# Altium project 电子脚铐便携式主控板V3-改版.PrjPcb
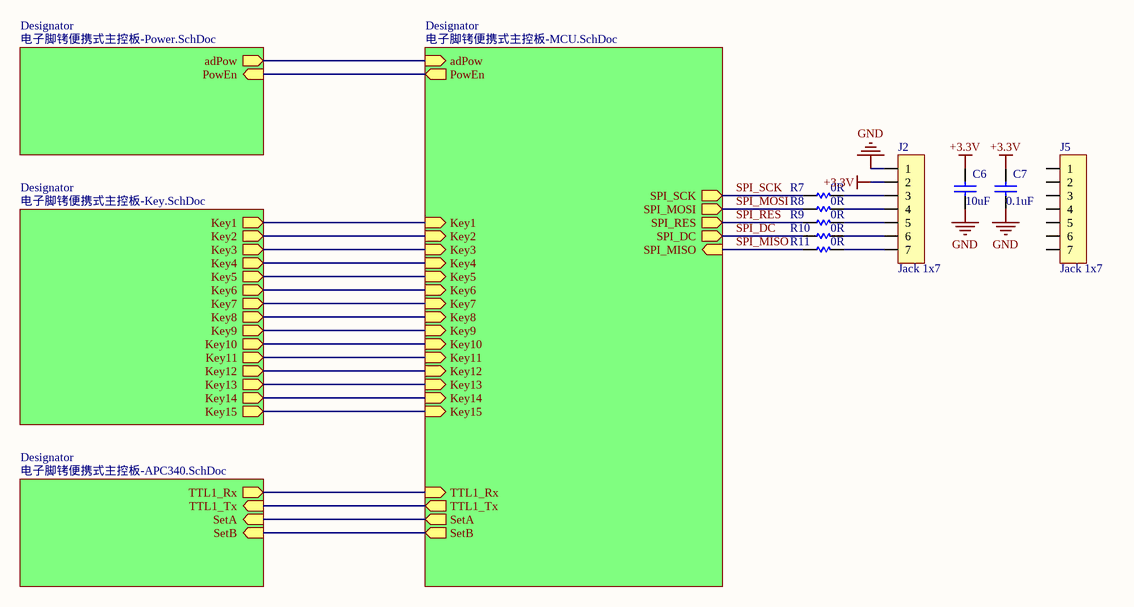
[diagram p0: 电子脚铐便携式主控板-Frame.SchDoc]
5 sheets, 104 parts. Net scope: hierarchical (ports join the sheet entries above them; power ports are global).
Board file: 电子脚铐便携式主控板V3-改版V1.PcbDoc
Sheets:
  电子脚铐便携式主控板-Frame.SchDoc
    Designator = 电子脚铐便携式主控板-Power.SchDoc
    Designator = 电子脚铐便携式主控板-Key.SchDoc
    Designator = 电子脚铐便携式主控板-MCU.SchDoc
    Designator = 电子脚铐便携式主控板-APC340.SchDoc

## Sheet 电子脚铐便携式主控板-Frame.SchDoc
size A4

### Parts
C6  10uF  [C0603]
C7  0.1uF  [C0603]
J2  Jack 1x7  [ZH-7AWD]
J5  Jack 1x7  [1.54OLED]
R7  0R  [R0603]
R8  0R  [R0603]
R9  0R  [R0603]
R10  0R  [R0603]
R11  0R  [R0603]

### Sub-sheets
Designator = 电子脚铐便携式主控板-Power.SchDoc: adPow (out), PowEn (in)
Designator = 电子脚铐便携式主控板-Key.SchDoc: Key1 (out), Key2 (out), Key3 (out), Key4 (out), Key5 (out), Key6 (out), Key7 (out), Key8 (out), Key9 (out), Key10 (out), Key11 (out), Key12 (out), Key13 (out), Key14 (out), Key15 (out)
Designator = 电子脚铐便携式主控板-MCU.SchDoc: adPow (in), PowEn (out), Key1 (in), Key2 (in), Key3 (in), Key4 (in), Key5 (in), Key6 (in), Key7 (in), Key8 (in), Key9 (in), Key10 (in), Key11 (in), Key12 (in), Key13 (in), Key14 (in), Key15 (in), TTL1_Rx (in), TTL1_Tx (out), SetA (out), SPI_MISO (in), SPI_MOSI (out), SPI_DC (out), SPI_SCK (out), SetB (out), SPI_RES (out)
Designator = 电子脚铐便携式主控板-APC340.SchDoc: TTL1_Rx (out), TTL1_Tx (in), SetA (in), SetB (in)

### Nets
+3.3V: C6.1 C7.1 J2.2
GND: C6.2 C7.2 J2.1
adPow: sheet Designator/adPow, sheet Designator/adPow
Key1: sheet Designator/Key1, sheet Designator/Key1
Key2: sheet Designator/Key2, sheet Designator/Key2
Key3: sheet Designator/Key3, sheet Designator/Key3
Key4: sheet Designator/Key4, sheet Designator/Key4
Key5: sheet Designator/Key5, sheet Designator/Key5
Key6: sheet Designator/Key6, sheet Designator/Key6
Key7: sheet Designator/Key7, sheet Designator/Key7
Key8: sheet Designator/Key8, sheet Designator/Key8
Key9: sheet Designator/Key9, sheet Designator/Key9
Key10: sheet Designator/Key10, sheet Designator/Key10
Key11: sheet Designator/Key11, sheet Designator/Key11
Key12: sheet Designator/Key12, sheet Designator/Key12
Key13: sheet Designator/Key13, sheet Designator/Key13
Key14: sheet Designator/Key14, sheet Designator/Key14
Key15: sheet Designator/Key15, sheet Designator/Key15
PowEn: sheet Designator/PowEn, sheet Designator/PowEn
SetA: sheet Designator/SetA, sheet Designator/SetA
SetB: sheet Designator/SetB, sheet Designator/SetB
SPI_DC: R10.1 ; sheet Designator/SPI_DC
SPI_MISO: R11.1 ; sheet Designator/SPI_MISO
SPI_MOSI: R8.1 ; sheet Designator/SPI_MOSI
SPI_RES: R9.1 ; sheet Designator/SPI_RES
SPI_SCK: R7.1 ; sheet Designator/SPI_SCK
TTL1_Rx: sheet Designator/TTL1_Rx, sheet Designator/TTL1_Rx
TTL1_Tx: sheet Designator/TTL1_Tx, sheet Designator/TTL1_Tx
NetJ2_3: J2.3 R7.2
NetJ2_4: J2.4 R8.2
NetJ2_5: J2.5 R9.2
NetJ2_6: J2.6 R10.2
NetJ2_7: J2.7 R11.2

Not connected (* = marked no-connect by the designer): J5 1 2 3 4 5 6 7

### Notes on the sheet
- 文件名:
- 审核:
- 制图人:
- 孟浩
- 校对:
- 图号:
- 批准:
- 日期:

### Library data of the parts
C6 C7 = CAP
J2 J5 = Jack 1x7: 插座
R7-R11 = Res

## Sheet 电子脚铐便携式主控板-Power.SchDoc
size A4
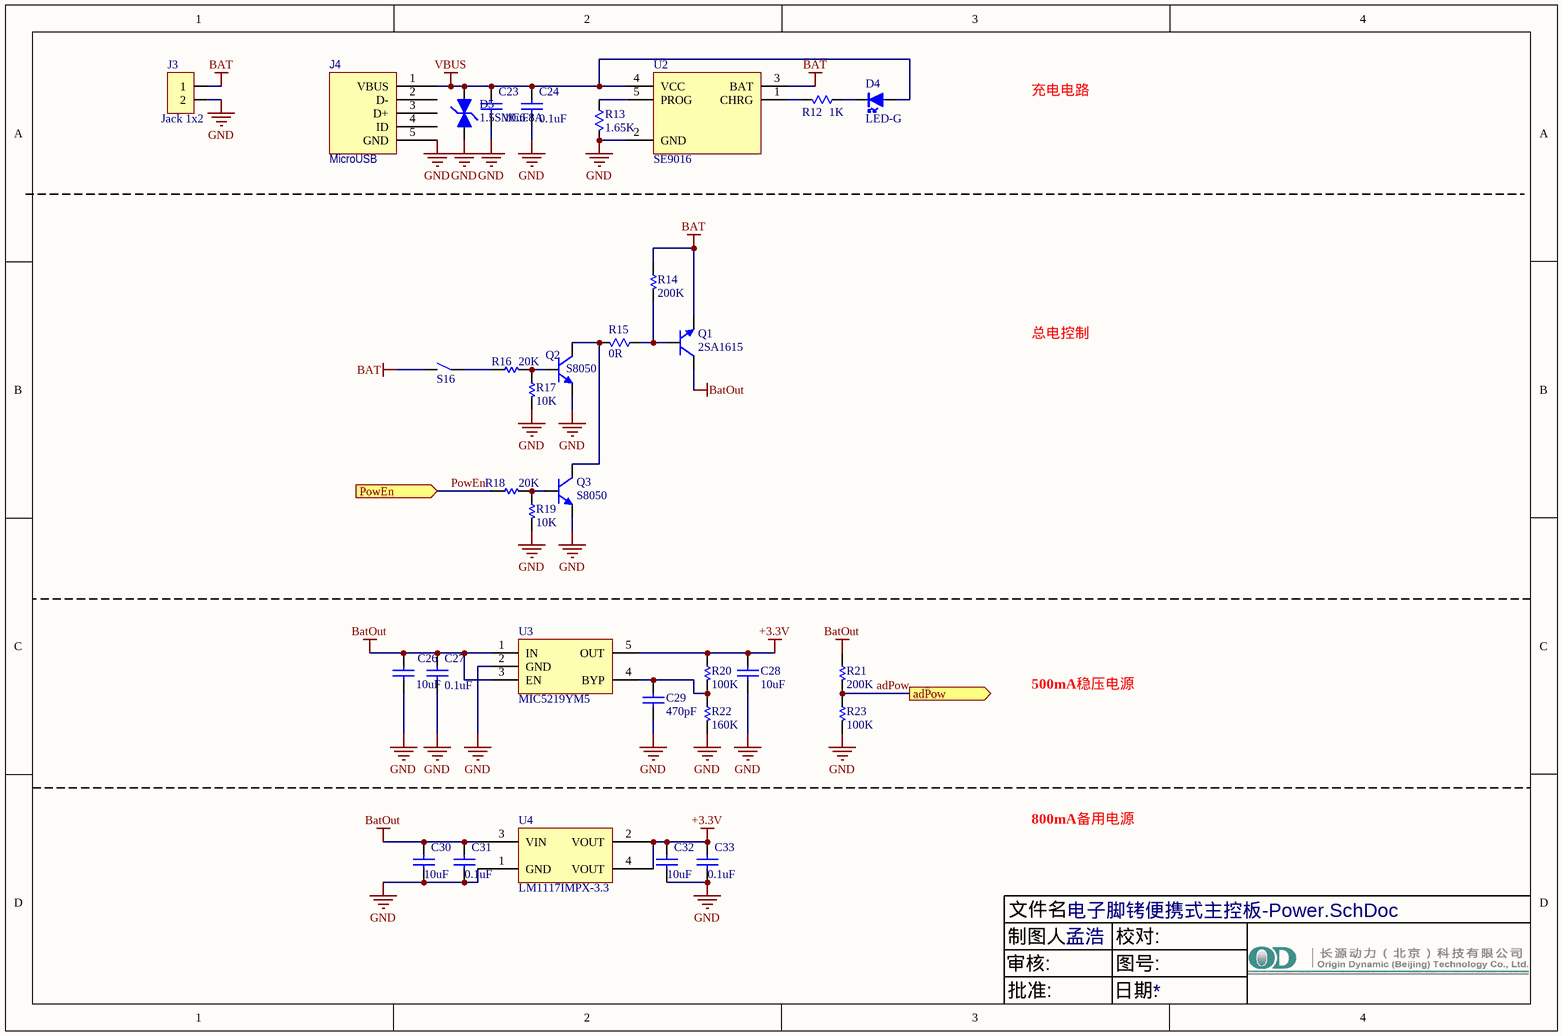
[diagram p1: 电子脚铐便携式主控板-Power.SchDoc]

### Parts
C23  10uF  [C1206]
C24  0.1uF  [C0603]
C26  10uF  [C0603]
C27  0.1uF  [C0603]
C28  10uF  [C0603]
C29  470pF  [C0603]
C30  10uF  [C0603]
C31  0.1uF  [C0603]
C32  10uF  [C0603]
C33  0.1uF  [C0603]
D4  LED-G  [LED0805]
D5  1.5SMC6.8A  [SMC]
J3  Jack 1x2  [DF13-2P-1.25V]
J4  MicroUSB  [MICRO-USB]
Q1  2SA1615  [TO-252]
Q2  S8050  [SOT-23]
Q3  S8050  [SOT-23]
R12  1K  [R0603]
R13  1.65K  [R0603]
R14  200K  [R0603]
R15  0R  [R0603]
R16  20K  [R0603]
R17  10K  [R0603]
R18  20K  [R0603]
R19  10K  [R0603]
R20  100K  [R0603]
R21  200K  [R0603]
R22  160K  [R0603]
R23  100K  [R0603]
S16  Switch  [SWITCH-H]  (value not drawn)
U2  SE9016  [SOT-23-5]
U3  MIC5219YM5  [SOT-23-5]
U4  LM1117IMPX-3.3  [SOT-223]

### Ports
adPow (out), PowEn (in)

### Nets
+3.3V: C28.1 C32.1 C33.1 R20.1 U3.5(OUT) U4.2(VOUT) U4.4(VOUT)
BAT: J3.1 Q1.3(E) R14.1 S16.2 U2.3(BAT)
BatOut: C26.1 C27.2 C30.1 C31.1 Q1.2(C) R21.1 U3.1(IN) U3.3(EN) U4.3(VIN)
GND: C23.2 C24.2 C26.2 C27.1 C28.2 C29.2 C30.2 C31.2 C32.2 C33.2 D5.2(K) J3.2 J4.5(GND) Q2.2(e) Q3.2(e) R13.1 R17.2 R19.2 R22.2 R23.2 U2.2(GND) U3.2(GND) U4.1(GND)
VBUS: C23.1 C24.1 D4.1(A) D5.1(A) J4.1(VBUS) U2.4(VCC)
adPow: R21.2 R23.1 ; port adPow
PowEn: R18.1 ; port PowEn
NetC29_1: C29.1 R20.2 R22.1 U3.4(BYP)
NetD4_2: D4.2(K) R12.2
NetQ1_1: Q1.1(B) R14.2 R15.1
NetQ2_1: Q2.1(b) R16.2 R17.1
NetQ2_3: Q2.3(c) Q3.3(c) R15.2
NetQ3_1: Q3.1(b) R18.2 R19.1
NetR12_1: R12.1 U2.1(CHRG)
NetR13_2: R13.2 U2.5(PROG)
NetR16_1: R16.1 S16.1

Not connected (* = marked no-connect by the designer): J4 2(D-) 3(D+) 4(ID)

### Notes on the sheet
- 充电电路
- 总电控制
- 500mA稳压电源
- 800mA备用电源
- 文件名:
- 审核:
- 制图人:
- 孟浩
- 校对:
- 图号:
- 批准:
- 日期:

### Library data of the parts
C23 C24 = Cap: Capacitor
  C23: Published: 8-Jun-2000; LatestRevisionDate: 17-Jul-2002; LatestRevisionNote: Re-released for DXP Platform.; PackageReference: RAD-0.3; Publisher: Altium Limited; PackageDescription: Radial Cap, Thru-Hole; 2 Leads; 0.3 in Pin Spacing; Value: 10uF
C26 C28-C33 = CAP
  C26 C28: Published: 8-Jun-2000; LatestRevisionDate: 17-Jul-2002; LatestRevisionNote: Re-released for DXP Platform.; PackageReference: RAD-0.3; Publisher: Altium Limited; Value: 10uF
  C29: Published: 8-Jun-2000; LatestRevisionDate: 17-Jul-2002; LatestRevisionNote: Re-released for DXP Platform.; PackageReference: RAD-0.3; Publisher: Altium Limited; Value: 470pF
C27 = Cap Semi
D4 = LED
D5 = Diode-TVS
J3 = Jack 1x2: 插座
Q1 = MJD122
Q2 Q3 = S8050: NPN triode, 0.5A Max
R12 R13 = Res: Resistor; Published: 8-Jun-2000; LatestRevisionDate: 04-Mar-2005; LatestRevisionNote: PCB Footprint replaced.; PackageReference: J1-0603; Publisher: Altium Limited
  R12: Value: 1K
  R13: Value: 1.65K
R14 R16-R23 = Res
R15 = RES: Resistor; Published: 8-Jun-2000; LatestRevisionDate: 17-Jul-2002; LatestRevisionNote: Re-released for DXP Platform.; PackageReference: AXIAL-0.3; Publisher: Altium Limited; Value: 0R
S16 = Sw
U3 = MIC5205
U4 = AMS1117: 800mA Low-Dropout Linear Regulator

## Sheet 电子脚铐便携式主控板-Key.SchDoc
size A4
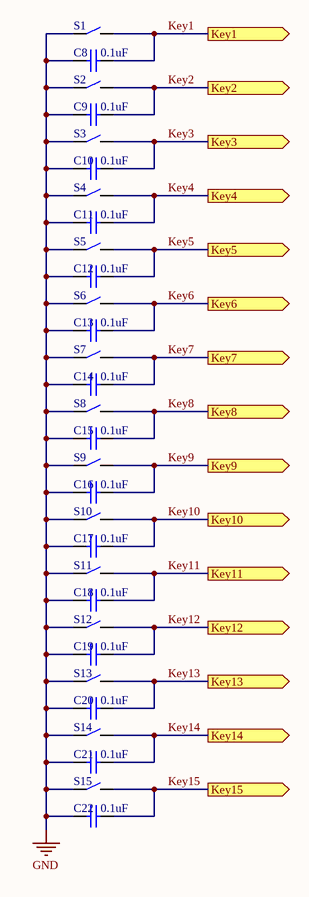
[diagram p2: 电子脚铐便携式主控板-Key.SchDoc]

### Parts
C8  0.1uF  [C0603]
C9  0.1uF  [C0603]
C10  0.1uF  [C0603]
C11  0.1uF  [C0603]
C12  0.1uF  [C0603]
C13  0.1uF  [C0603]
C14  0.1uF  [C0603]
C15  0.1uF  [C0603]
C16  0.1uF  [C0603]
C17  0.1uF  [C0603]
C18  0.1uF  [C0603]
C19  0.1uF  [C0603]
C20  0.1uF  [C0603]
C21  0.1uF  [C0603]
C22  0.1uF  [C0603]
S1  Switch  [B3F-4055]  (value not drawn)
S2  Switch  [B3F-4055]  (value not drawn)
S3  Switch  [B3F-4055]  (value not drawn)
S4  Switch  [B3F-4055]  (value not drawn)
S5  Switch  [B3F-4055]  (value not drawn)
S6  Switch  [B3F-4055]  (value not drawn)
S7  Switch  [B3F-4055]  (value not drawn)
S8  Switch  [B3F-4055]  (value not drawn)
S9  Switch  [B3F-4055]  (value not drawn)
S10  Switch  [B3F-4055]  (value not drawn)
S11  Switch  [B3F-4055]  (value not drawn)
S12  Switch  [B3F-4055]  (value not drawn)
S13  Switch  [B3F-4055]  (value not drawn)
S14  Switch  [B3F-4055]  (value not drawn)
S15  Switch  [B3F-4055]  (value not drawn)

### Ports
Key1 (out), Key2 (out), Key3 (out), Key4 (out), Key5 (out), Key6 (out), Key7 (out), Key8 (out), Key9 (out), Key10 (out), Key11 (out), Key12 (out), Key13 (out), Key14 (out), Key15 (out)

### Nets
GND: C8.2 C9.2 C10.2 C11.2 C12.2 C13.2 C14.2 C15.2 C16.2 C17.2 C18.2 C19.2 C20.2 C21.2 C22.2 S1.1 S2.1 S3.1 S4.1 S5.1 S6.1 S7.1 S8.1 S9.1 S10.1 S11.1 S12.1 S13.1 S14.1 S15.1
Key1: C8.1 S1.2 ; port Key1
Key2: C9.1 S2.2 ; port Key2
Key3: C10.1 S3.2 ; port Key3
Key4: C11.1 S4.2 ; port Key4
Key5: C12.1 S5.2 ; port Key5
Key6: C13.1 S6.2 ; port Key6
Key7: C14.1 S7.2 ; port Key7
Key8: C15.1 S8.2 ; port Key8
Key9: C16.1 S9.2 ; port Key9
Key10: C17.1 S10.2 ; port Key10
Key11: C18.1 S11.2 ; port Key11
Key12: C19.1 S12.2 ; port Key12
Key13: C20.1 S13.2 ; port Key13
Key14: C21.1 S14.2 ; port Key14
Key15: C22.1 S15.2 ; port Key15

### Notes on the sheet
- 文件名:
- 审核:
- 制图人:
- 孟浩
- 校对:
- 图号:
- 批准:
- 日期:

### Library data of the parts
C8-C22 = Cap Semi
S1-S15 = Sw

## Sheet 电子脚铐便携式主控板-MCU.SchDoc
size A4
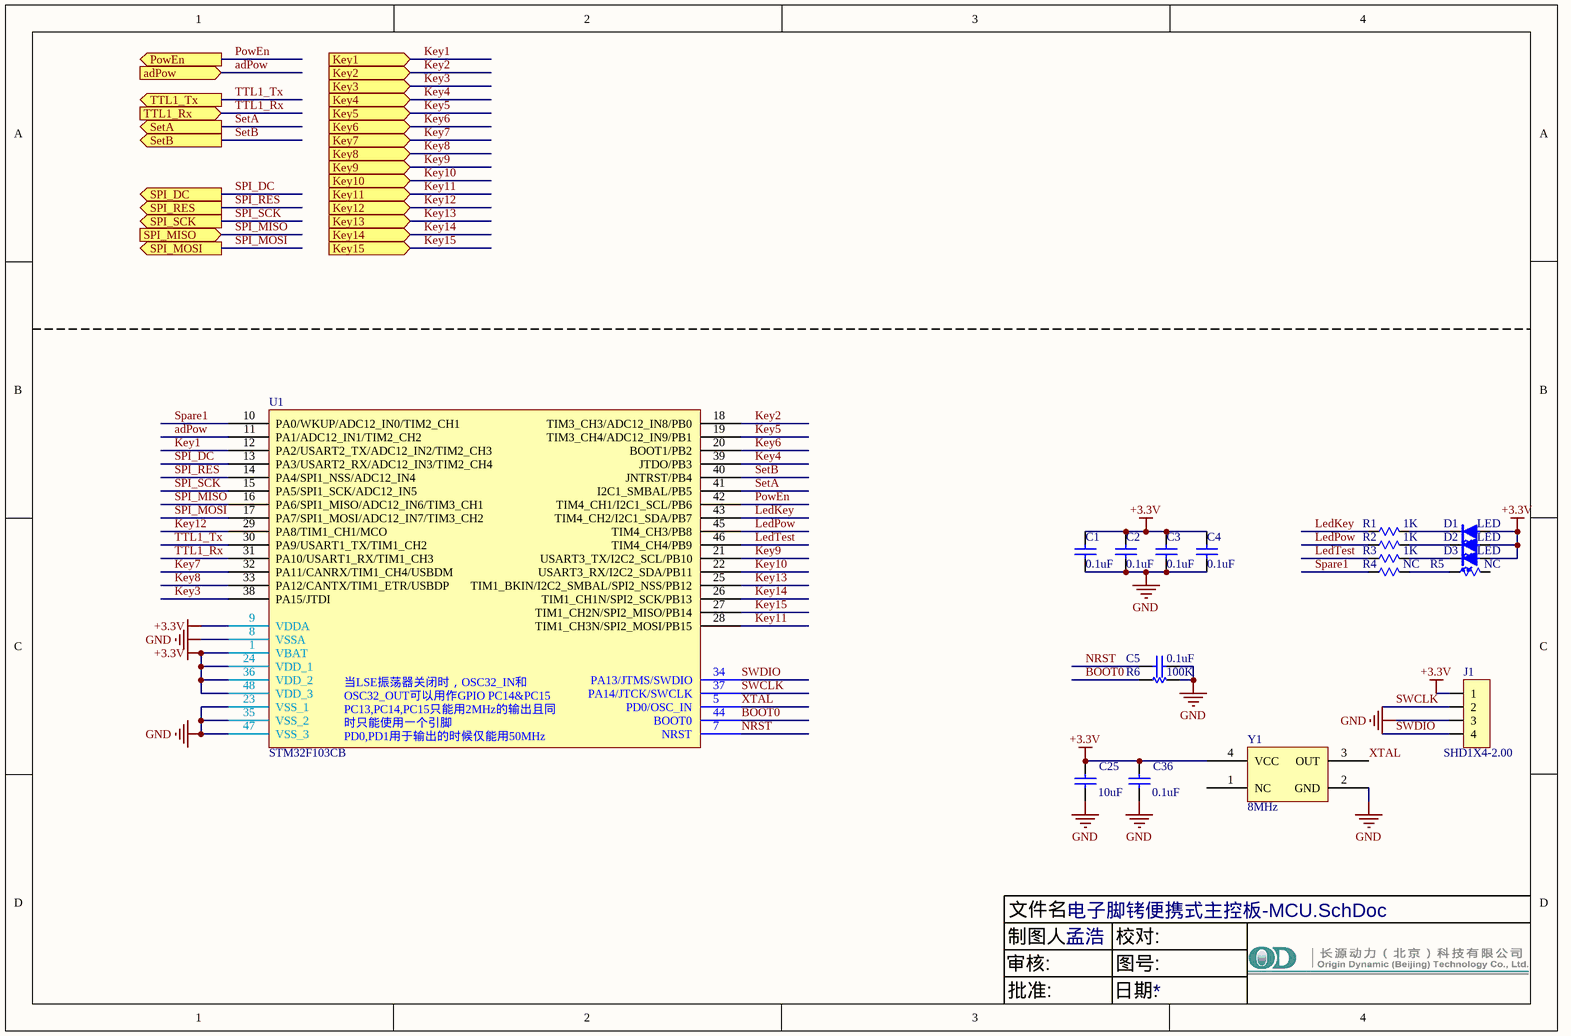
[diagram p3: 电子脚铐便携式主控板-MCU.SchDoc]

### Parts
C1  0.1uF  [C0603]
C2  0.1uF  [C0603]
C3  0.1uF  [C0603]
C4  0.1uF  [C0603]
C5  0.1uF  [C0603]
C25  10uF  [C0603]
C36  0.1uF  [C0603]
D1  LED  [LED0805]
D2  LED  [LED0805]
D3  LED  [LED0805]
J1  SHD1X4-2.00  [Jk1*4-2.0]
R1  1K  [R0603]
R2  1K  [R0603]
R3  1K  [R0603]
R4  NC  [R0603]
R5  NC  [R0603]
R6  100K  [R0603]
U1  STM32F103CB  [LQFP48]
Y1  8MHz  [XTAL5032]

### Ports
adPow (in), Key1 (in), Key2 (in), Key3 (in), Key4 (in), Key5 (in), Key6 (in), Key7 (in), Key8 (in), Key9 (in), Key10 (in), Key11 (in), Key12 (in), Key13 (in), Key14 (in), Key15 (in), PowEn (out), SetA (out), SetB (out), SPI_DC (out), SPI_MISO (in), SPI_MOSI (out), SPI_RES (out), SPI_SCK (out), TTL1_Rx (in), TTL1_Tx (out)

### Nets
+3.3V: C1.1 C2.1 C3.1 C4.1 C25.2 C36.2 D1.1(A) D2.1(A) D3.1(A) J1.1 U1.1(VBAT) U1.9(VDDA) U1.24(VDD_1) U1.36(VDD_2) U1.48(VDD_3) Y1.4(VCC)
GND: C1.2 C2.2 C3.2 C4.2 C5.2 C25.1 C36.1 J1.3 R6.2 U1.8(VSSA) U1.23(VSS_1) U1.35(VSS_2) U1.47(VSS_3) Y1.2(GND)
adPow: U1.11(PA1/ADC12_IN1/TIM2_CH2) ; port adPow
BOOT0: R6.1 U1.44(BOOT0)
Key1: U1.12(PA2/USART2_TX/ADC12_IN2/TIM2_CH3) ; port Key1
Key2: U1.18(TIM3_CH3/ADC12_IN8/PB0) ; port Key2
Key3: U1.38(PA15/JTDI) ; port Key3
Key4: U1.39(JTDO/PB3) ; port Key4
Key5: U1.19(TIM3_CH4/ADC12_IN9/PB1) ; port Key5
Key6: U1.20(BOOT1/PB2) ; port Key6
Key7: U1.32(PA11/CANRX/TIM1_CH4/USBDM) ; port Key7
Key8: U1.33(PA12/CANTX/TIM1_ETR/USBDP) ; port Key8
Key9: U1.21(USART3_TX/I2C2_SCL/PB10) ; port Key9
Key10: U1.22(USART3_RX/I2C2_SDA/PB11) ; port Key10
Key11: U1.28(TIM1_CH3N/SPI2_MOSI/PB15) ; port Key11
Key12: U1.29(PA8/TIM1_CH1/MCO) ; port Key12
Key13: U1.25(TIM1_BKIN/I2C2_SMBAL/SPI2_NSS/PB12) ; port Key13
Key14: U1.26(TIM1_CH1N/SPI2_SCK/PB13) ; port Key14
Key15: U1.27(TIM1_CH2N/SPI2_MISO/PB14) ; port Key15
LedKey: R1.2 U1.43(TIM4_CH2/I2C1_SDA/PB7)
LedPow: R2.2 U1.45(TIM4_CH3/PB8)
LedTest: R3.2 U1.46(TIM4_CH4/PB9)
NRST: C5.1 U1.7(NRST)
PowEn: U1.42(TIM4_CH1/I2C1_SCL/PB6) ; port PowEn
SetA: U1.41(I2C1_SMBAL/PB5) ; port SetA
SetB: U1.40(JNTRST/PB4) ; port SetB
Spare1: R4.2 U1.10(PA0/WKUP/ADC12_IN0/TIM2_CH1)
SPI_DC: U1.13(PA3/USART2_RX/ADC12_IN3/TIM2_CH4) ; port SPI_DC
SPI_MISO: U1.16(PA6/SPI1_MISO/ADC12_IN6/TIM3_CH1) ; port SPI_MISO
SPI_MOSI: U1.17(PA7/SPI1_MOSI/ADC12_IN7/TIM3_CH2) ; port SPI_MOSI
SPI_RES: U1.14(PA4/SPI1_NSS/ADC12_IN4) ; port SPI_RES
SPI_SCK: U1.15(PA5/SPI1_SCK/ADC12_IN5) ; port SPI_SCK
SWCLK: J1.2 U1.37(PA14/JTCK/SWCLK)
SWDIO: J1.4 U1.34(PA13/JTMS/SWDIO)
TTL1_Rx: U1.31(PA10/USART1_RX/TIM1_CH3) ; port TTL1_Rx
TTL1_Tx: U1.30(PA9/USART1_TX/TIM1_CH2) ; port TTL1_Tx
XTAL: U1.5(PD0/OSC_IN) Y1.3(OUT)
NetD1_2: D1.2(K) R1.1
NetD2_2: D2.2(K) R2.1
NetD3_2: D3.2(K) R3.1
NetR4_1: R4.1 R5.2

Not connected (* = marked no-connect by the designer): R5 1; U1 2(PC13-TAMPER-RTC) 3(PC14-OSC32_IN) 4(PC15-OSC32_OUT) 6(PD1/OSC_OUT); Y1 1(NC)

### Notes on the sheet
- 文件名:
- 审核:
- 制图人:
- 孟浩
- 校对:
- 图号:
- 批准:
- 日期:
- (in symbol STM32F103Cx) OSC32_IN和OSC32_OUT可以用作通用IO PC14和PC15; PC13,PC14,PC15只能用于2MHz的输出模式且同时只能使用一个引脚; 当LSE振荡器关闭时，OSC32_IN和OSC32_OUT可以用作GPIO PC14&PC15 / PC13,PC14,PC15只能用2MHz的输出且同时只能使用一个引脚 / PD0,PD1用于输出的时候仅能用50MHz

### Library data of the parts
C1-C5 C25 C36 = Cap Semi
J1 = HEADER1X4
R1-R5 = Res: Resistor; Published: 8-Jun-2000; LatestRevisionDate: 04-Mar-2005; LatestRevisionNote: PCB Footprint replaced.; PackageReference: J1-0603; Publisher: Altium Limited
  R1-R3: Value: 1K
  R4 R5: Value: NC
R6 = Res
U1 = STM32F103Cx
Y1 = XTAL: SM crystal oscilator

## Sheet 电子脚铐便携式主控板-APC340.SchDoc
size A4
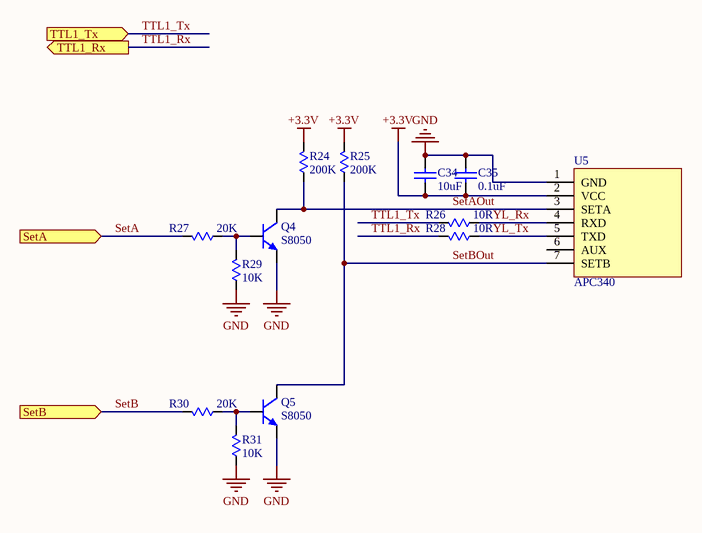
[diagram p4: 电子脚铐便携式主控板-APC340.SchDoc]

### Parts
C34  10uF  [C0603]
C35  0.1uF  [C0603]
Q4  S8050  [SOT-23]
Q5  S8050  [SOT-23]
R24  200K  [R0603]
R25  200K  [R0603]
R26  value 10R  [R0603]  (hidden comment: 200K)
R27  value 20K  [R0603]  (hidden comment: 200K)
R28  value 10R  [R0603]  (hidden comment: 200K)
R29  10K  [R0603]
R30  value 20K  [R0603]  (hidden comment: 200K)
R31  10K  [R0603]
U5  APC340  [APC340]

### Ports
SetA (in), SetB (in), TTL1_Rx (out), TTL1_Tx (in)

### Nets
+3.3V: C34.1 C35.1 R24.2 R25.2 U5.2(VCC)
GND: C34.2 C35.2 Q4.2(e) Q5.2(e) R29.1 R31.1 U5.1(GND)
SetA: R27.2 ; port SetA
SetAOut: Q4.3(c) R24.1 U5.3(SETA)
SetB: R30.2 ; port SetB
SetBOut: Q5.3(c) R25.1 U5.7(SETB)
TTL1_Rx: R28.2 ; port TTL1_Rx
TTL1_Tx: R26.2 ; port TTL1_Tx
YL_Rx: R26.1 U5.4(RXD)
YL_Tx: R28.1 U5.5(TXD)
NetQ4_1: Q4.1(b) R27.1 R29.2
NetQ5_1: Q5.1(b) R30.1 R31.2

Not connected (* = marked no-connect by the designer): U5 6(AUX)

### Notes on the sheet
- 文件名:
- 审核:
- 制图人:
- 孟浩
- 校对:
- 图号:
- 批准:
- 日期:

### Library data of the parts
C34 C35 = CAP: Published: 8-Jun-2000; LatestRevisionDate: 17-Jul-2002; LatestRevisionNote: Re-released for DXP Platform.; PackageReference: RAD-0.3; Publisher: Altium Limited
  C34: Value: 10uF
  C35: Value: 0.1uF
Q4 Q5 = S8050: NPN triode, 0.5A Max
R24-R31 = RES: Resistor; Published: 8-Jun-2000; LatestRevisionDate: 17-Jul-2002; LatestRevisionNote: Re-released for DXP Platform.; PackageReference: AXIAL-0.3; Publisher: Altium Limited
  R24 R25: Value: 200K
  R29 R31: Value: 10K

## Nets that join several sheets
+3.3V: 电子脚铐便携式主控板-Frame (C6.1 C7.1 J2.2), 电子脚铐便携式主控板-Power (7 pins), 电子脚铐便携式主控板-MCU (16 pins), 电子脚铐便携式主控板-APC340 (5 pins)
GND: 电子脚铐便携式主控板-Frame (C6.2 C7.2 J2.1), 电子脚铐便携式主控板-Power (23 pins), 电子脚铐便携式主控板-Key (30 pins), 电子脚铐便携式主控板-MCU (14 pins), 电子脚铐便携式主控板-APC340 (7 pins)
adPow: 电子脚铐便携式主控板-Power (R21.2 R23.1), 电子脚铐便携式主控板-MCU (U1.11)
Key1: 电子脚铐便携式主控板-Key (C8.1 S1.2), 电子脚铐便携式主控板-MCU (U1.12)
Key2: 电子脚铐便携式主控板-Key (C9.1 S2.2), 电子脚铐便携式主控板-MCU (U1.18)
Key3: 电子脚铐便携式主控板-Key (C10.1 S3.2), 电子脚铐便携式主控板-MCU (U1.38)
Key4: 电子脚铐便携式主控板-Key (C11.1 S4.2), 电子脚铐便携式主控板-MCU (U1.39)
Key5: 电子脚铐便携式主控板-Key (C12.1 S5.2), 电子脚铐便携式主控板-MCU (U1.19)
Key6: 电子脚铐便携式主控板-Key (C13.1 S6.2), 电子脚铐便携式主控板-MCU (U1.20)
Key7: 电子脚铐便携式主控板-Key (C14.1 S7.2), 电子脚铐便携式主控板-MCU (U1.32)
Key8: 电子脚铐便携式主控板-Key (C15.1 S8.2), 电子脚铐便携式主控板-MCU (U1.33)
Key9: 电子脚铐便携式主控板-Key (C16.1 S9.2), 电子脚铐便携式主控板-MCU (U1.21)
Key10: 电子脚铐便携式主控板-Key (C17.1 S10.2), 电子脚铐便携式主控板-MCU (U1.22)
Key11: 电子脚铐便携式主控板-Key (C18.1 S11.2), 电子脚铐便携式主控板-MCU (U1.28)
Key12: 电子脚铐便携式主控板-Key (C19.1 S12.2), 电子脚铐便携式主控板-MCU (U1.29)
Key13: 电子脚铐便携式主控板-Key (C20.1 S13.2), 电子脚铐便携式主控板-MCU (U1.25)
Key14: 电子脚铐便携式主控板-Key (C21.1 S14.2), 电子脚铐便携式主控板-MCU (U1.26)
Key15: 电子脚铐便携式主控板-Key (C22.1 S15.2), 电子脚铐便携式主控板-MCU (U1.27)
PowEn: 电子脚铐便携式主控板-Power (R18.1), 电子脚铐便携式主控板-MCU (U1.42)
SetA: 电子脚铐便携式主控板-MCU (U1.41), 电子脚铐便携式主控板-APC340 (R27.2)
SetB: 电子脚铐便携式主控板-MCU (U1.40), 电子脚铐便携式主控板-APC340 (R30.2)
SPI_DC: 电子脚铐便携式主控板-Frame (R10.1), 电子脚铐便携式主控板-MCU (U1.13)
SPI_MISO: 电子脚铐便携式主控板-Frame (R11.1), 电子脚铐便携式主控板-MCU (U1.16)
SPI_MOSI: 电子脚铐便携式主控板-Frame (R8.1), 电子脚铐便携式主控板-MCU (U1.17)
SPI_RES: 电子脚铐便携式主控板-Frame (R9.1), 电子脚铐便携式主控板-MCU (U1.14)
SPI_SCK: 电子脚铐便携式主控板-Frame (R7.1), 电子脚铐便携式主控板-MCU (U1.15)
TTL1_Rx: 电子脚铐便携式主控板-MCU (U1.31), 电子脚铐便携式主控板-APC340 (R28.2)
TTL1_Tx: 电子脚铐便携式主控板-MCU (U1.30), 电子脚铐便携式主控板-APC340 (R26.2)